# Altium project emoc.PrjPcb
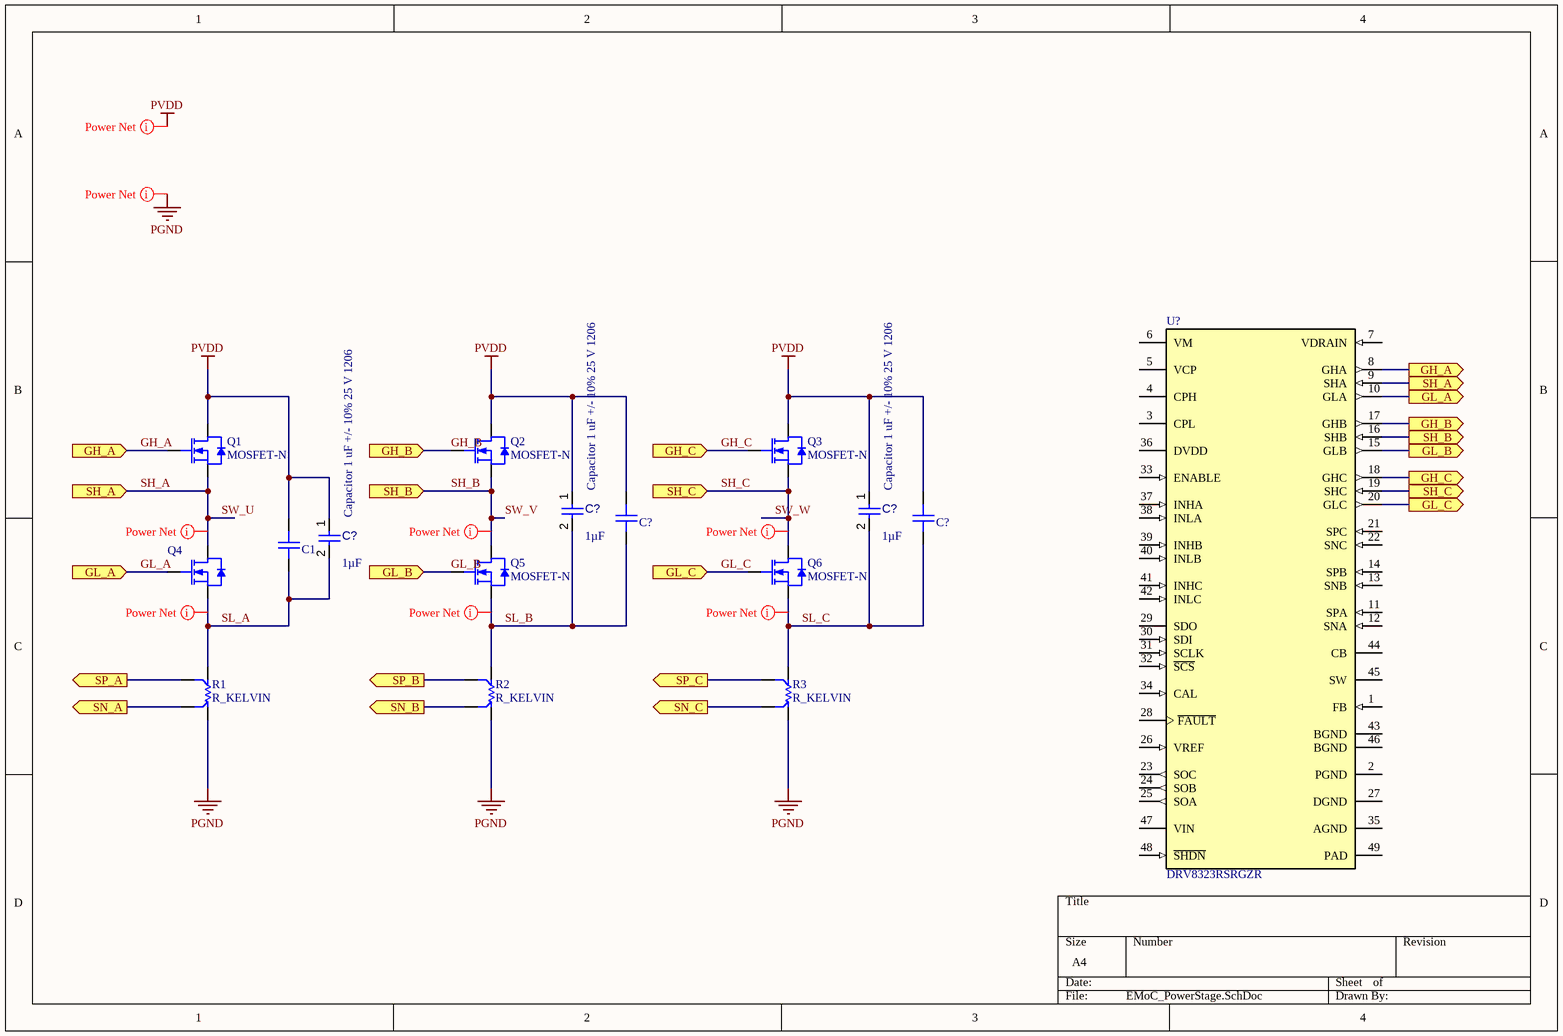
[diagram p0: EMoC_PowerStage.SchDoc]
2 sheets, 21 parts. Net scope: flat (ports and power ports of the same name join across sheets).
Board file: emoc.PcbDoc
Sheets:
  EMoC_PowerStage.SchDoc
  EMoC_Contoller.SchDoc

## Sheet EMoC_PowerStage.SchDoc
size A4

### Parts
(Parts that share a designator on the sheet are numbered #1, #2 ... from top to bottom, then left to right.)
C1  (no value)  [C0603N]
C?#1  Capacitor 1 uF +/- 10% 25 V 1206  value 1µF  [CAPC3216X180X20ML20]
C?#2  Capacitor 1 uF +/- 10% 25 V 1206  value 1µF  [CAPC3216X180X20ML20]
C?#3  Capacitor 1 uF +/- 10% 25 V 1206  value 1µF  [CAPC3216X180X20ML20]
C?#4  (no value)  [C0603N]
C?#5  (no value)  [C0603N]
Q1  MOSFET-N  [DFN-5 (SO-8FL)]
Q2  MOSFET-N  [DFN-5 (SO-8FL)]
Q3  MOSFET-N  [DFN-5 (SO-8FL)]
Q4  MOSFET-N  [DFN-5 (SO-8FL)]  (value not drawn)
Q5  MOSFET-N  [DFN-5 (SO-8FL)]
Q6  MOSFET-N  [DFN-5 (SO-8FL)]
R1  R_KELVIN  [CSS2H-2512N_KELVIN]
R2  R_KELVIN  [CSS2H-2512N_KELVIN]
R3  R_KELVIN  [CSS2H-2512N_KELVIN]
U?#1  DRV8323RSRGZR  [QFN50P700X700X100_HS-49N]

### Ports
GH_A (in), GH_A (out), GH_B (in), GH_B (out), GH_C (in), GH_C (out), GL_A (in), GL_A (out), GL_B (in), GL_B (out), GL_C (in), GL_C (out), SH_A (in), SH_A (out), SH_B (in), SH_B (out), SH_C (in), SH_C (out), SN_A (out), SN_B (out), SN_C (out), SP_A (out), SP_B (out), SP_C (out)

### Nets
PGND: R1.1 R2.1 R3.1
PVDD: C1.2 C?#1.1 C?#2.1 C?#3.1 C?#4.2 C?#5.2 Q1.D Q2.D Q3.D
GH_A: Q1.G U?#1.8(GHA) ; port GH_A
GH_B: Q2.G U?#1.17(GHB) ; port GH_B
GH_C: Q3.G U?#1.18(GHC) ; port GH_C
GL_A: Q4.G U?#1.10(GLA) ; port GL_A
GL_B: Q5.G U?#1.15(GLB) ; port GL_B
GL_C: Q6.G U?#1.20(GLC) ; port GL_C
SH_A: Q1.S Q4.D U?#1.9(SHA) ; port SH_A  [also labelled SW_U]
SH_B: Q2.S Q5.D U?#1.16(SHB) ; port SH_B  [also labelled SW_V]
SH_C: Q3.S Q6.D U?#1.19(SHC) ; port SH_C  [also labelled SW_W]
SL_A: C1.1 C?#3.2 Q4.S R1.2
SL_B: C?#1.2 C?#4.1 Q5.S R2.2
SL_C: C?#2.2 C?#5.1 Q6.S R3.2
NetR1_3: R1.3 ; port SN_A
NetR1_4: R1.4 ; port SP_A
NetR2_3: R2.3 ; port SN_B
NetR2_4: R2.4 ; port SP_B
NetR3_3: R3.3 ; port SN_C
NetR3_4: R3.4 ; port SP_C

Not connected (* = marked no-connect by the designer): U?#1 1(FB) 2(PGND) 3(CPL) 4(CPH) 5(VCP) 6(VM) 7(VDRAIN) 11(SPA) 12(SNA) 13(SNB) 14(SPB) 21(SPC) 22(SNC) 23(SOC) 24(SOB) 25(SOA) 26(VREF) 27(DGND) 28(~{FAULT}) 29(SDO) 30(SDI) 31(SCLK) 32(~{SCS}) 33(ENABLE) 34(CAL) 35(AGND) 36(DVDD) 37(INHA) 38(INLA) 39(INHB) 40(INLB) 41(INHC) 42(INLC) 43(BGND) 44(CB) 45(SW) 46(BGND) 47(VIN) 48(~{SHDN}) 49(PAD)

### Layout directives
net class Power: PGND, PVDD, SH_A, SH_B, SH_C, SL_A, SL_B, SL_C

### Notes on the sheet
- Labels drawn without touching a wire or pin: PGND, PVDD

### Library data of the parts
C1 C?#4 C?#5 = C
C?#1-C?#3 = CMP-001-00006-4: Chip Capacitor, 1 uF, +/- 10%, 25 V, 1206 (3216 Metric); Voltage Rating: 25V; Capacitor Type: Ceramic; RoHS Compliant: True; Pins: 2; Min Operating Temperature: -55°C; Mounting Technology: SM; Max Operating Temperature: 125°C; Tolerance: 10%; Case/Package: 1206
U?#1 = CMP-031-00006-2: IC, THREE-PHASE GATE DRIVER, 6-60V, 48QFN; Max Supply Voltage: 60V; Interface: SPI; Max Gate Driver Output Current: 1A(Source), 2A(Sink); Min Supply Voltage: 6V; Min Operating Temperature: -40°C; RoHS Compliant: Y; ComponentLink2URL: https://www.ti.com/product/DRV8323R; Packaging: Cut Tape; ComponentLink2Description: Manufacturer Product Page; Mounting Technology: SMT; Mount: Surface Mount; Max Operating Temperature: 125°C; Case/Package: 48-VQFN; ComponentLink1URL: https://www.ti.com/lit/ds/symlink/drv8323r.pdf; ComponentLink1Description: Datasheet

## Sheet EMoC_Contoller.SchDoc
size A4
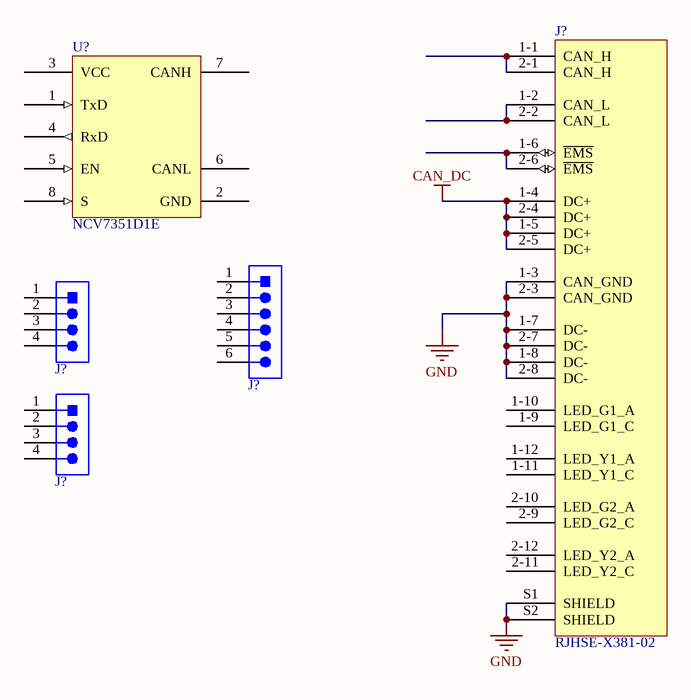
[diagram p1: EMoC_Contoller.SchDoc]

### Parts
(Parts that share a designator on the sheet are numbered #1, #2 ... from top to bottom, then left to right.)
J?#1  S6B-ZR  [S6B-ZR]  (value not drawn)
J?#2  1744426-4  [1744426-4]  (value not drawn)
J?#3  RJHSE-X381-02  [RJHSE-X38X-02]
J?#4  1744426-4  [1744426-4]  (value not drawn)
U?#2  NCV7351D1E  [SOIC127P600X175-8N]

### Nets
CAN_DC: J?#3.1-4(DC+) J?#3.1-5(DC+) J?#3.2-4(DC+) J?#3.2-5(DC+)
GND: J?#3.1-3(CAN_GND) J?#3.1-7(DC-) J?#3.1-8(DC-) J?#3.2-3(CAN_GND) J?#3.2-7(DC-) J?#3.2-8(DC-) J?#3.S1(SHIELD) J?#3.S2(SHIELD)
NetJ?#3_1-1: J?#3.1-1(CAN_H) J?#3.2-1(CAN_H)
NetJ?#3_1-2: J?#3.1-2(CAN_L) J?#3.2-2(CAN_L)
NetJ?#3_1-6: J?#3.1-6(~{EMS}) J?#3.2-6(~{EMS})

Not connected (* = marked no-connect by the designer): J?#1 1 2 3 4 5 6; J?#2 1 2 3 4; J?#3 1-9(LED_G1_C) 1-10(LED_G1_A) 1-11(LED_Y1_C) 1-12(LED_Y1_A) 2-9(LED_G2_C) 2-10(LED_G2_A) 2-11(LED_Y2_C) 2-12(LED_Y2_A); J?#4 1 2 3 4; U?#2 1(TxD) 2(GND) 3(VCC) 4(RxD) 5(EN) 6(CANL) 7(CANH) 8(S)

### Library data of the parts
J?#1 = S6B-ZR: CON, HEADER, 6POS, 1.5mm, R/A, THT; Manufacturer 1: JST; Manufacturer Part Number 1: S6B-ZR
J?#2 J?#4 = 1744426-4: CON, HEADER, EP2.5, 4POS, R/A, THT; Manufacturer 1: TE Connectivity; Manufacturer Part Number 1: 1744426-4
U?#2 = CMP-014-0000-1: Source: libysk_passive.SchLib; Design Item ID: NCV7351D1E